# Altium schematic sheet USB.SchDoc
size A
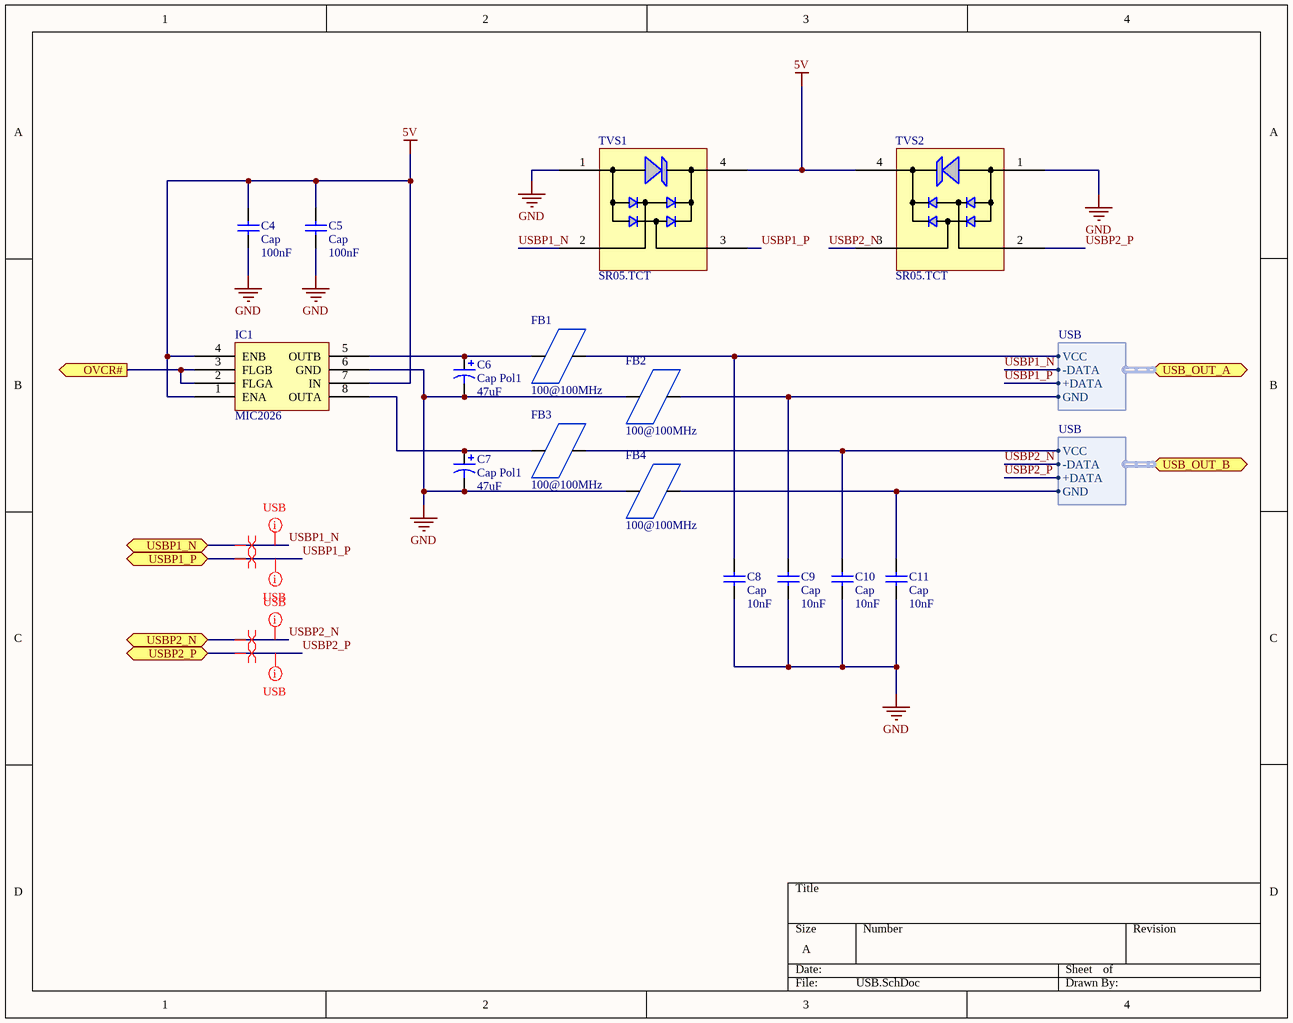
[diagram p0: USB.SchDoc]

## Parts
C4  Cap  value 100nF  [0603]
C5  Cap  value 100nF  [0603]
C6  Cap Pol1  value 47uF  [CAPPR5-5x5]
C7  Cap Pol1  value 47uF  [CAPPR5-5x5]
C8  Cap  value 10nF  [0603]
C9  Cap  value 10nF  [0603]
C10  Cap  value 10nF  [0603]
C11  Cap  value 10nF  [0603]
FB1  100@100MHz  [INDC1608X09N]
FB2  100@100MHz  [INDC1608X09N]
FB3  100@100MHz  [INDC1608X09N]
FB4  100@100MHz  [INDC1608X09N]
IC1  MIC2026  [8-Pin SOIC]
TVS1  SR05.TCT  [SOT143]
TVS2  SR05.TCT  [SOT143]

## Ports
OVCR# (out), USB_OUT_A (harness USB), USB_OUT_B (harness USB), USBP1_N (bidir), USBP1_P (bidir), USBP2_N (bidir), USBP2_P (bidir)

## Harnesses
USB: VCC, -DATA, +DATA, GND

## Nets
5V: C4.2 C5.2 IC1.1(ENA) IC1.4(ENB) IC1.7(IN) TVS1.4 TVS2.4
GND: C4.1 C5.1 C6.2 C7.2 C8.1 C9.1 C10.1 C11.1 FB2.1 FB4.1 IC1.6(GND) TVS1.1 TVS2.1
OVCR#: IC1.2(FLGA) IC1.3(FLGB) ; port OVCR#
USBP1_N: TVS1.2 ; port USBP1_N, port USB_OUT_A.-DATA
USBP1_P: TVS1.3 ; port USBP1_P, port USB_OUT_A.+DATA
USBP2_N: TVS2.3 ; port USBP2_N, port USB_OUT_B.-DATA
USBP2_P: TVS2.2 ; port USBP2_P, port USB_OUT_B.+DATA
NetC6_1: C6.1 FB1.1 IC1.5(OUTB)
NetC7_1: C7.1 FB3.1 IC1.8(OUTA)
NetC8_2: C8.2 FB1.2 ; port USB_OUT_A.VCC
NetC9_2: C9.2 FB2.2 ; port USB_OUT_A.GND
NetC10_2: C10.2 FB3.2 ; port USB_OUT_B.VCC
NetC11_2: C11.2 FB4.2 ; port USB_OUT_B.GND

## Layout directives
differential pair: USBP1_N, USBP1_P, USBP2_N, USBP2_P
rule Length Constraint [Min Length = 0mil    Max Length = 15000mil]; rule Impedance Constraint [Min = 0.000    Max = 105.0    ]; rule Width Constraint [Pref Width = 7mil    Min Width = 7mil    Max Width = 7mil]; rule Differential Pairs Routing [Pref Gap = 5mil    Min Gap  = 5mil    Max Gap  = 10mil]; rule Maximum Via Count Constraint [Max Count = 4]: USBP1_N, USBP1_P, USBP2_N, USBP2_P

## Library data of the parts
C4 C5 C8-C11 = Cap: Capacitor; Published: 8-Jun-2000; LatestRevisionDate: 17-Jul-2002; LatestRevisionNote: Re-released for DXP Platform.; PackageReference: RAD-0.3; Publisher: Altium Limited; Supplier: DigiKey
  C4 C5: Supplier Part #: 587-1245-1-ND
  C8-C11: Supplier Part #: 490-1512-1-ND
C6 C7 = Cap Pol1: Polarized Capacitor (Radial); Published: 8-Jun-2000; LatestRevisionDate: 17-Jul-2002; LatestRevisionNote: Re-released for DXP Platform.; PackageReference: RB7.6-15; Publisher: Altium Limited; Supplier Part #: P5137-ND; Supplier: DigiKey
FB1-FB4 = Ferrite Bead: Supplier Part #: 587-1922-1-ND; Supplier: DigiKey
IC1 = MIC2026: Micrel MIC2026 Dual-Channel Power Distribution Switch; Model: MIC2026; Supplier Part #: 576-1059-1-ND; Supplier: DigiKey
TVS1 TVS2 = SR05.TCT: IC TVS ARRAY 2-LINE 5V SOT-143; Model: SR05; Supplier Part #: SR05CT-ND; Supplier: DigiKey